# EAGLE design SAOT (EAGLE 9.6.2)
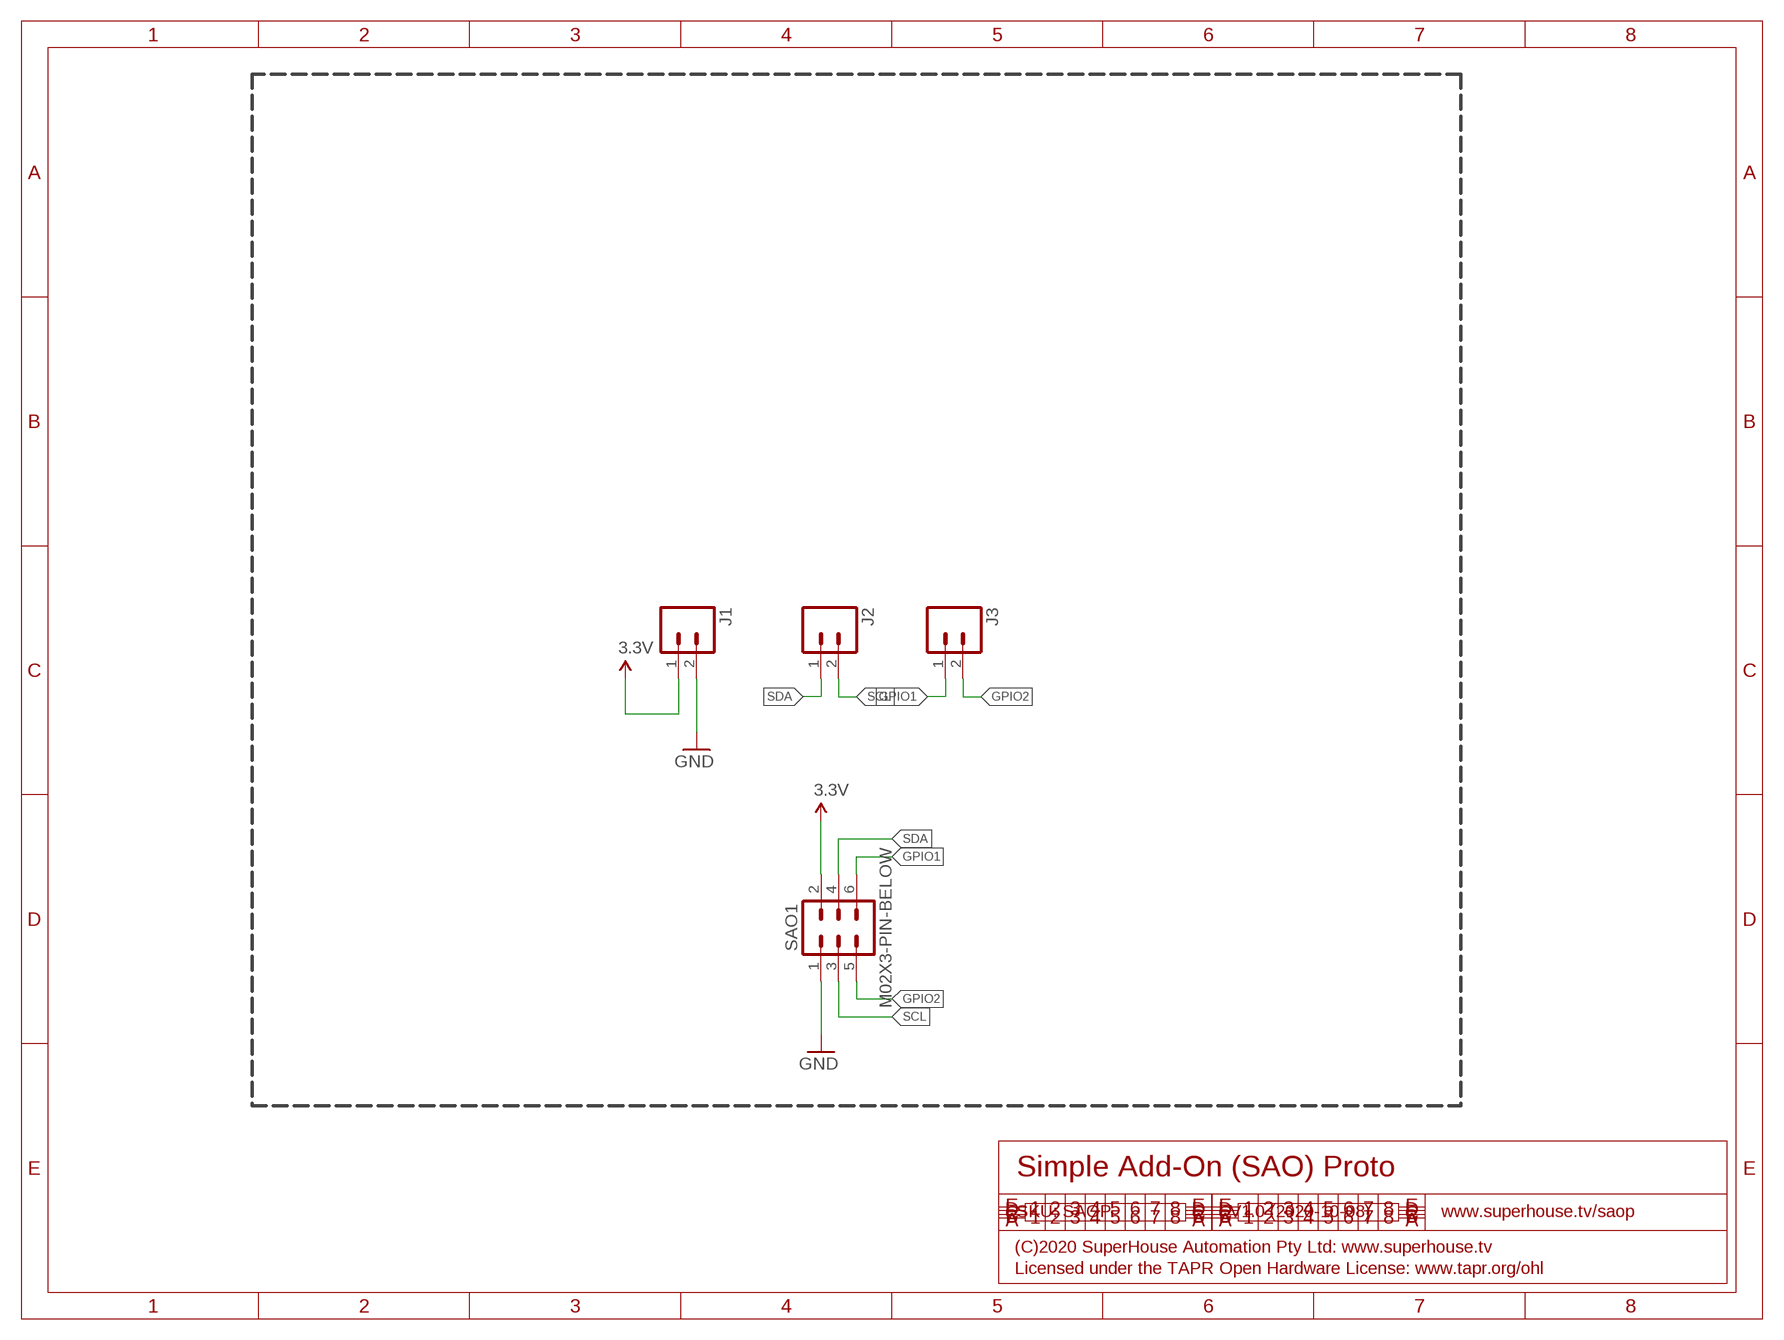
[diagram p0: schematic, sheet 1]

## Parts
J1  M02-SCREW-3.5MM  [SCREWTERMINAL-3.5MM-2]
J2  M02-SCREW-3.5MM  [SCREWTERMINAL-3.5MM-2]
J3  M02-SCREW-3.5MM  [SCREWTERMINAL-3.5MM-2]
SAO1  M02X3-PIN-BELOW  [2X03-P-BELOW]

## Nets
3.3V: J1.1 SAO1.2
GND: J1.2 SAO1.1
GPIO1: J3.1 SAO1.6
GPIO2: J3.2 SAO1.5
SCL: J2.2 SAO1.3
SDA: J2.1 SAO1.4

## Notes on the sheet
- Simple Add-On (SAO) Proto
- SKU: SAOP | V1.0 (2020-10-08) | www.superhouse.tv/saop
- (C)2020 SuperHouse Automation Pty Ltd: www.superhouse.tv
- Licensed under the TAPR Open Hardware License: www.tapr.org/ohl

## Library data of the parts
J1-J3 = SuperHouse-Connectors:M02: 2-way header Standard 1x2 header, and screw terminal variations
SAO1 = SuperHouse-Connectors:M02X3: M6 header in 2x3 format

## Net classes
0 default: width 0.203 mm, drill 0.356 mm, clearance 0.152 mm
1 power: width 0.203 mm, clearance 0.152 mm

## Board
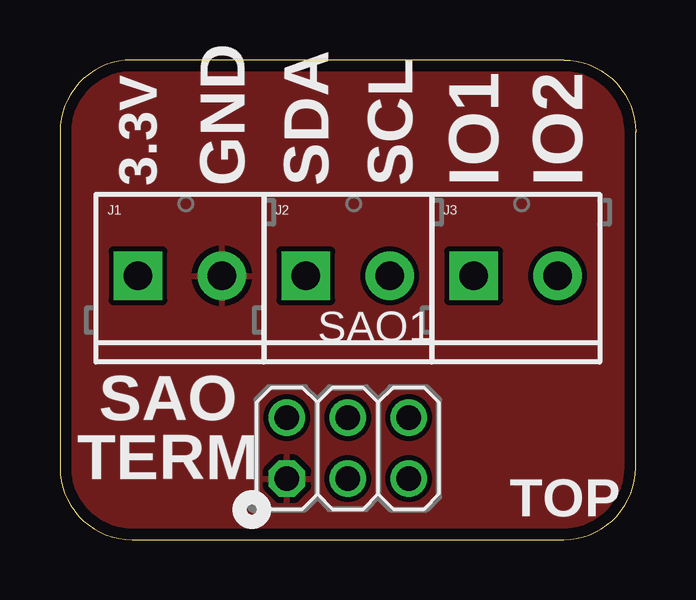
[diagram p1: board, top side]
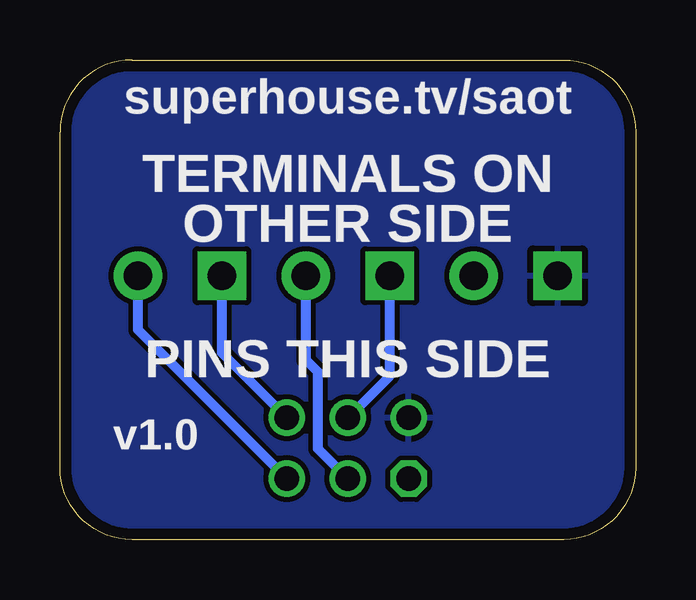
[diagram p2: board, bottom side, seen from below]

Size 24 x 20 mm. Coordinates in mm from the lower left corner, seen from the top.
Outline: 3,0 21,0 arc90 24,3 24,17 arc90 21,20 3,20 arc90 0,17 0,3 arc90 3,0
Copper layers (1*16): Top 0.035mm / dielectric 1.5mm / Bottom 0.035mm
Design rules "SuperHouse-Design-Rules": minimum track width 10mil, minimum drill 24mil, track to track 8mil, track to pad 8mil, pad to pad 8mil, via to via 8mil, smd to smd 6mil, copper to edge 18mil, drill to drill 8mil, minimum pad ring 7mil, minimum via ring 8mil, stop-mask expansion 4mil, vias tented up to drill 0.5mm, thermal gap 10mil

### Footprints (pad centres in the part's own frame; a part is rotated, then mirrored left to right if it is on the bottom)
SCREWTERMINAL-3.5MM-2 = drill 1.2 pad 2.032 square: 1 -1.75,0 | drill 1.2 pad 2.032: 2 1.75,0
2X03-P-BELOW = drill 1.016 octagon: 1 -2.54,-1.27 | drill 1.016: 2 -2.54,1.27; 3 0,-1.27; 4 0,1.27; 5 2.54,-1.27; 6 2.54,1.27

### Placement (x,y rotation side)
J1  5,11 0 top
J2  12,11 0 top
J3  19,11 0 top
SAO1  12,3.81 0 top

### Tracks (layer width: path | path; a pad name or v marks a point on that pad's centre or on a via)
3.3V
  pour Bottom: 3,0 arc-90 0,3 0,17 arc-90 3,20 21,20 arc-90 24,17 24,3 arc-90 21,0
GND
  pour Top: 21,0 3,0 arc-90 0,3 0,17 arc-90 3,20 21,20 arc-90 24,17 24,3 arc-90
GPIO1
  Bottom 0.406: SAO1.6 17.25,7.79 J3.1
GPIO2
  Bottom 0.406: SAO1.5 20.75,8.75 J3.2
SCL
  Bottom 0.406: SAO1.3 13.25,3.79 13.25,7 13.75,7.5 J2.2
SDA
  Bottom 0.406: SAO1.4 10.25,6.83 J2.1

### Text on the board
tPlace: 3.3V | GND | SDA | SCL | IO1 | IO2 | SAO / TERM | TOP
bPlace: superhouse.tv/saot | TERMINALS ON / OTHER SIDE | PINS THIS SIDE | v1.0